# EAGLE design df12-20dp-breakout (EAGLE 8.3.2)
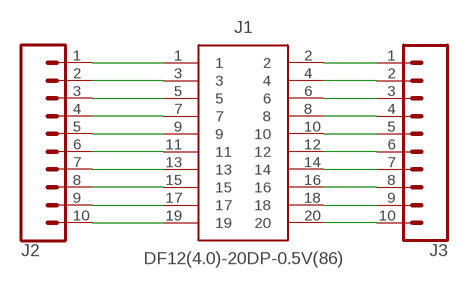
[diagram p0: schematic, sheet 1]

## Parts
J1  DF12(4.0)-20DP-0.5V(86)  [DF12(4.0)-20DP]
J2  CONN_10LOCK_LONGPADS  [1X10_LOCK_LONGPADS]
J3  CONN_10LOCK_LONGPADS  [1X10_LOCK_LONGPADS]

## Nets
N$1: J1.17 J2.9
N$2: J1.15 J2.8
N$3: J1.13 J2.7
N$4: J1.11 J2.6
N$5: J1.9 J2.5
N$6: J1.7 J2.4
N$7: J1.19 J2.10
N$8: J1.5 J2.3
N$9: J1.3 J2.2
N$10: J1.1 J2.1
N$11: J1.2 J3.1
N$12: J1.4 J3.2
N$13: J1.6 J3.3
N$14: J1.8 J3.4
N$15: J1.10 J3.5
N$16: J1.12 J3.6
N$17: J1.14 J3.7
N$18: J1.16 J3.8
N$19: J1.18 J3.9
N$20: J1.20 J3.10

## Library data of the parts
J1 = DF12(4.0)-20DP-0.5V(86):DF12(4.0)-20DP-0.5V(86): Connector,Board to Board,DF12 Hirose DF12 Series, 0.5mm Pitch 20 Way 2 Row Straight PCB Header, Solder Termination, 0.3A <https://componentsearchengine.com/Images/3/DF12%284.0%29-20DP-0.5V%2886%29.jpg> Source: Datasheet <http://uk.rs-online.com/web/p/products/6082121>; ALLIED_NUMBER: R1051077; DESCRIPTION: Connector,Board to Board,DF12 Hirose DF12 Series, 0.5mm Pitch 20 Way 2 Row Straight PCB Header, Solder Termination, 0.3A; HEIGHT: mm; MANUFACTURER_NAME: Hirose; MANUFACTURER_PART_NUMBER: DF12(4.0)-20DP-0.5V(86); RS_PART_NUMBER: 6082121P; SUPPLIER_NAME: RS
J2 J3 = SparkFun-Connectors:CONN_10: Multi connection point. Often used as Generic Header-pin footprint for 0.1 inch spaced/style header connections On any of the 0.1 inch spaced packages, you can populate with these: Break Away Headers - Straight <https://www.sparkfun.com/products/116> (PRT-00116) Break Away Male Headers - Right Angle <https://www.sparkfun.com/products/553> (PRT-00553) Female Headers <https://www.sparkfun.com/products/115> (PRT-00115) Break Away Headers - Machine Pin <https://www.sparkfun.com/products/117> (PRT-00117) Break Away Female Headers - Swiss Machine Pin <https://www.sparkfun.com/products/743> (PRT-00743) Arduino Stackable Header - 10 Pin <https://www.sparkfun.com/products/11376> (PRT-11376) For SCREWTERMINALS and SPRING TERMINALS visit here: Screw Terimnals on SparkFun.com <https://www.sparkfun.com/search/results?term=Screw+Terminals> (5mm/3.5mm/2.54mm spacing) This device is also useful as a general connection point to wire up your design to another part of your project. Our various solder wires solder well into these plated through hole pads. Hook-Up Wire - Assortment (Stranded, 22 AWG) <https://www.sparkfun.com/products/11375> (PRT-11375) Hook-Up Wire - Assortment (Solid Core, 22 AWG) <https://www.sparkfun.com/products/11367> (PRT-11367) View the entire wire category on our website here <https://www.sparkfun.com/categories/141> Special notes: Molex polarized connector foot print use with SKU : PRT-08231 with associated crimp pins and housings. 1MM SMD Version SKU: PRT-10208 NOTES ON THE VARIANTS LOCK and LOCK_LONGPADS... This footprint was designed to help hold the alignment of a through-hole component (i.e. 6-pin header) while soldering it into place. You may notice that each hole has been shifted either up or down by 0.005 of an inch from it's more standard position (which is a perfectly straight line). This slight alteration caused the pins (the squares in the middle) to touch the edges of the holes. Because they are alternating, it causes a "brace" to hold the component in place. 0.005 has proven to be the perfect amount of "off-center" position when using our standard breakaway headers. Although looks a little odd when you look at the bare footprint, once you have a header in there, the alteration is very hard to notice. Also,if you push a header all the way into place, it is covered up entirely on the bottom side.

## Board
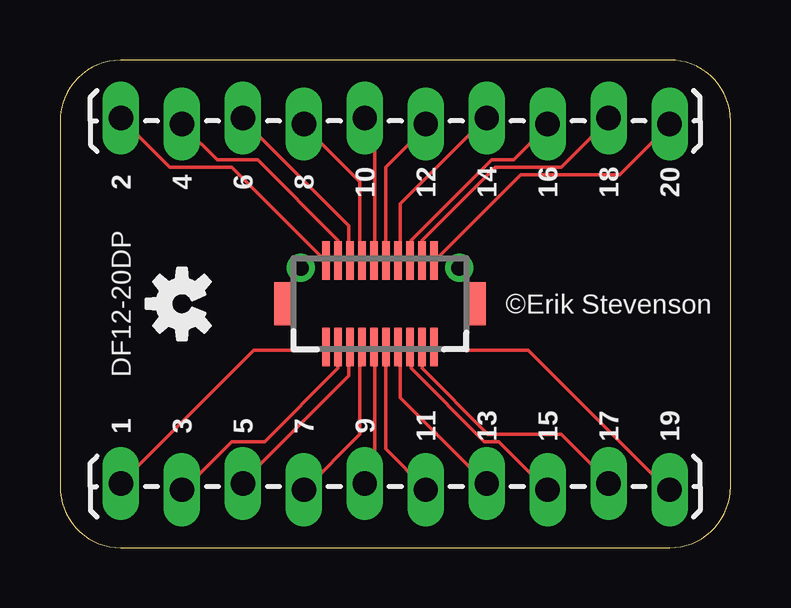
[diagram p1: board, top side]

Size 27.94 x 20.32 mm. Coordinates in mm from the lower left corner, seen from the top.
Outline: 0,17.77 0,2.54 arc90 2.54,0 25.4,0 arc90 27.94,2.54 27.94,17.78 arc90 25.4,20.32 2.54,20.31 arc90 0,17.77
Copper layers (1*16): Top 0.035mm / dielectric 1.5mm / Bottom 0.035mm
Design rules "default": minimum track width 6mil, minimum drill 0.35mm, track to track 6mil, track to pad 6mil, pad to pad 6mil, via to via 6mil, smd to smd 6mil, copper to edge 40mil, drill to drill 6mil, minimum pad ring 10mil, minimum via ring 8mil, stop-mask expansion 4mil, vias tented up to drill 0mil, thermal gap 10mil

### Footprints (pad centres in the part's own frame; a part is rotated, then mirrored left to right if it is on the bottom)
DF12(4.0)-20DP = smd 0.3 x 1.6: 1 -2.25,-1.8; 2 -2.25,1.8; 3 -1.75,-1.8; 4 -1.75,1.8; 5 -1.25,-1.8; 6 -1.25,1.8; 7 -0.75,-1.8; 8 -0.75,1.8; 9 -0.25,-1.8; 10 -0.25,1.8; 11 0.25,-1.8; 12 0.25,1.8; 13 0.75,-1.8; 14 0.75,1.8; 15 1.25,-1.8; 16 1.25,1.8; 17 1.75,-1.8; 18 1.75,1.8; 19 2.25,-1.8; 20 2.25,1.8 | drill 0.65 pad 1.15: 21 -3.3,1.5; 24 3.3,1.5 | smd 0.8 x 1.8: 22 -4,0; 23 4,0
1X10_LOCK_LONGPADS = drill 1.016 long: 1 0,0.127; 2 2.54,-0.127; 3 5.08,0.127; 4 7.62,-0.127; 5 10.16,0.127; 6 12.7,-0.127; 7 15.24,0.127; 8 17.78,-0.127; 9 20.32,0.127; 10 22.86,-0.127

### Placement (x,y rotation side)
J1  13.34,10.16 0 top
J2  2.54,2.54 0 top
J3  2.54,17.78 0 top
U$1  [OSHW-LOGO-S]  5.08,10.16 90 top

### Tracks (layer width: path | path; a pad name or v marks a point on that pad's centre or on a via)
N$1
  Top 0.152: J1.17 15.09,8.23 15.09,7.47 17.83,4.72 20.88,4.72 22.86,2.74 J2.9
N$2
  Top 0.152: J1.15 14.63,8.23 14.63,7.47 17.68,4.42 18.29,4.42 20.27,2.44 J2.8
N$3
  Top 0.152: J1.13 14.17,8.23 14.17,6.25 17.68,2.74 J2.7
N$4
  Top 0.152: J1.11 13.56,8.23 13.56,4.12 15.24,2.44 J2.6
N$5
  Top 0.152: J1.9 13.11,8.23 13.11,3.05 12.8,2.74 J2.5
N$6
  Top 0.152: J1.7 12.5,8.23 12.5,4.72 10.21,2.44 J2.4
N$7
  Top 0.152: J1.19 15.7,8.23 19.51,8.23 25.3,2.44 J2.10
N$8
  Top 0.152: J1.5 12.04,8.23 12.04,7.16 7.62,2.74 J2.3
N$9
  Top 0.152: J1.3 11.58,8.23 11.58,7.47 8.53,4.42 7.16,4.42 5.18,2.44 J2.2
N$10
  Top 0.152: J1.1 10.97,8.23 8.08,8.23 2.59,2.74 J2.1
N$11
  Top 0.152: J1.2 10.97,12.04 7.16,15.85 4.57,15.85 2.59,17.83 J3.1
N$12
  Top 0.152: J1.4 11.58,12.04 11.58,12.8 8.23,16.15 6.55,16.15 5.18,17.53 J3.2
N$13
  Top 0.152: J1.6 12.04,12.04 12.04,13.41 7.62,17.83 J3.3
N$14
  Top 0.152: J1.8 12.5,12.04 12.5,15.24 10.21,17.53 J3.4
N$15
  Top 0.152: J1.10 13.11,12.04 13.11,17.53 12.8,17.83 J3.5
N$16
  Top 0.152: J1.12 13.56,12.04 13.56,15.85 15.24,17.53 J3.6
N$17
  Top 0.152: J1.14 14.17,12.04 14.17,14.33 17.68,17.83 J3.7
N$18
  Top 0.152: J1.16 14.63,12.04 14.63,12.8 17.98,16.15 18.9,16.15 20.27,17.53 J3.8
N$19
  Top 0.152: J1.18 15.09,12.04 15.09,12.8 18.14,15.85 20.88,15.85 22.86,17.83 J3.9
N$20
  Top 0.152: J1.20 15.7,12.04 19.2,15.54 23.32,15.54 25.3,17.53 J3.10

### Text on the board
tPlace: 2 | 4 | 6 | 8 | 10 | 12 | 14 | 16 | 18 | 20 | DF12-20DP | ©Erik Stevenson | 1 | 3 | 5 | 7 | 9 | 11 | 13 | 15 | 17 | 19